# EAGLE design shift-register-daughter (EAGLE 6.6.0)
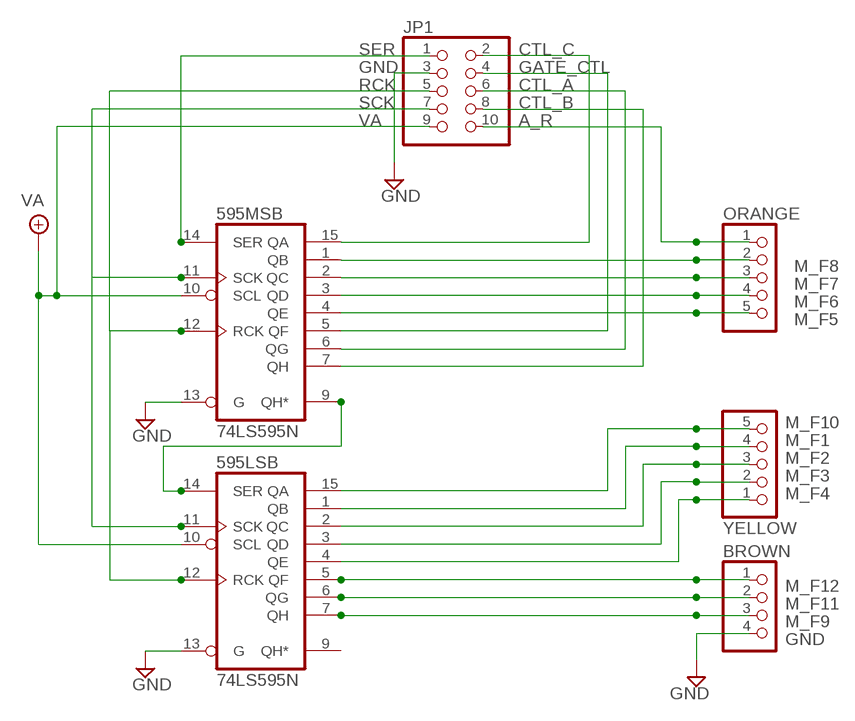
[diagram p0: schematic, sheet 1]

## Parts
595LSB  74LS595N  [DIL16]
595MSB  74LS595N  [DIL16]
BROWN  PINHD-1X4  [1X04]
JP1  PINHD-2X5  [2X05]
ORANGE  PINHD-1X5  [1X05]
YELLOW  PINHD-1X5  [1X05]

## Nets
A_R: JP1.10 ORANGE.1
CTL_A: 595MSB.6(QG) JP1.6
CTL_B: 595MSB.7(QH) JP1.8
CTL_C: 595MSB.15(QA) JP1.2
GATE_CTL: 595MSB.5(QF) JP1.4
GND: 595LSB.13(G) 595MSB.13(G) BROWN.4 JP1.3
M_F1: 595LSB.1(QB) YELLOW.4
M_F2: 595LSB.2(QC) YELLOW.3
M_F3: 595LSB.3(QD) YELLOW.2
M_F4: 595LSB.4(QE) YELLOW.1
M_F5: 595MSB.4(QE) ORANGE.5
M_F6: 595MSB.3(QD) ORANGE.4
M_F7: 595MSB.2(QC) ORANGE.3
M_F8: 595MSB.1(QB) ORANGE.2
M_F9: 595LSB.7(QH) BROWN.3
M_F10: 595LSB.15(QA) YELLOW.5
M_F11: 595LSB.6(QG) BROWN.2
M_F12: 595LSB.5(QF) BROWN.1
N$1: 595LSB.14(SER) 595MSB.9(QH*)
RCK: 595LSB.12(RCK) 595MSB.12(RCK) JP1.5
SCK: 595LSB.11(SCK) 595MSB.11(SCK) JP1.7
SER: 595MSB.14(SER) JP1.1
VA: 595LSB.10(SCL) 595MSB.10(SCL) JP1.9
Unconnected: 595LSB.9(QH*)

## Power pins joined to a net without a drawn wire
GND: 595LSB.8(GND) 595MSB.8(GND)
VCC: 595LSB.16(VCC) 595MSB.16(VCC)

## Library data of the parts
595LSB 595MSB = 74xx-us:74*595: 8-bit SHIFT REGISTER, output latch
BROWN = pinhead:PINHD-1X4: PIN HEADER
JP1 = pinhead:PINHD-2X5: PIN HEADER
ORANGE YELLOW = pinhead:PINHD-1X5: PIN HEADER

## Board
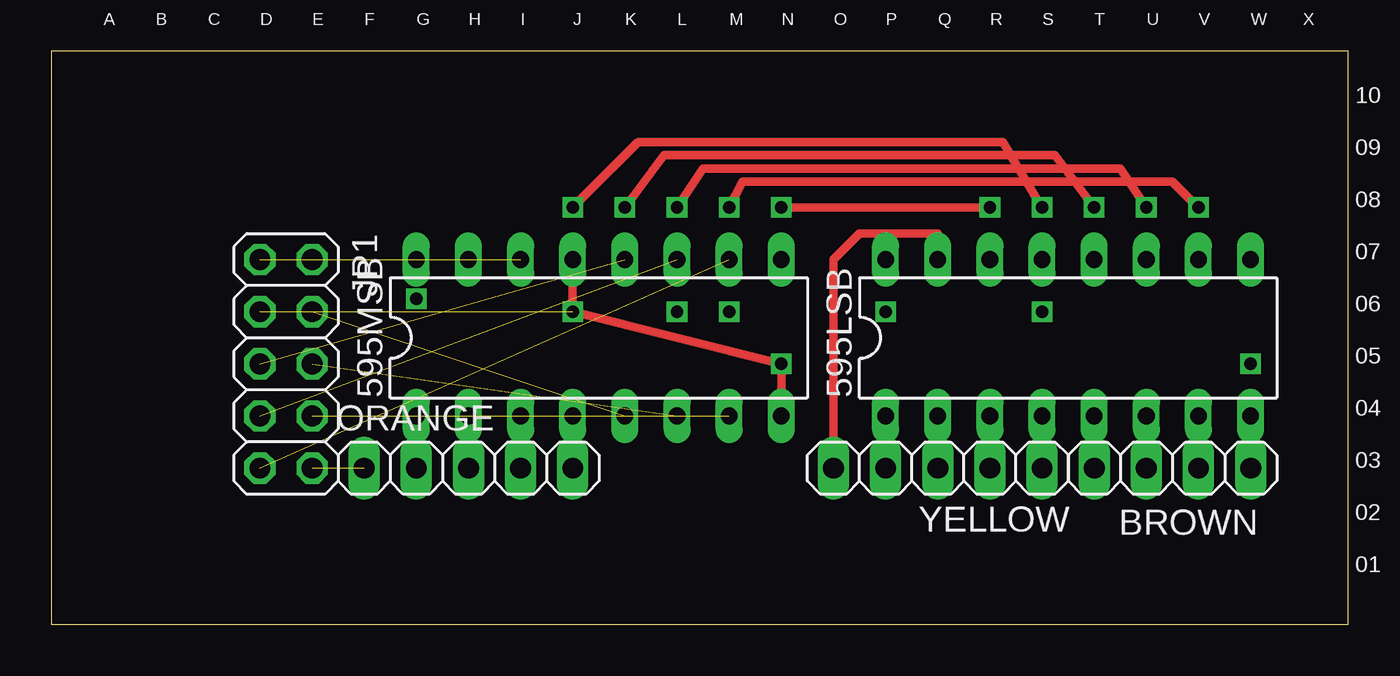
[diagram p1: board, top side]
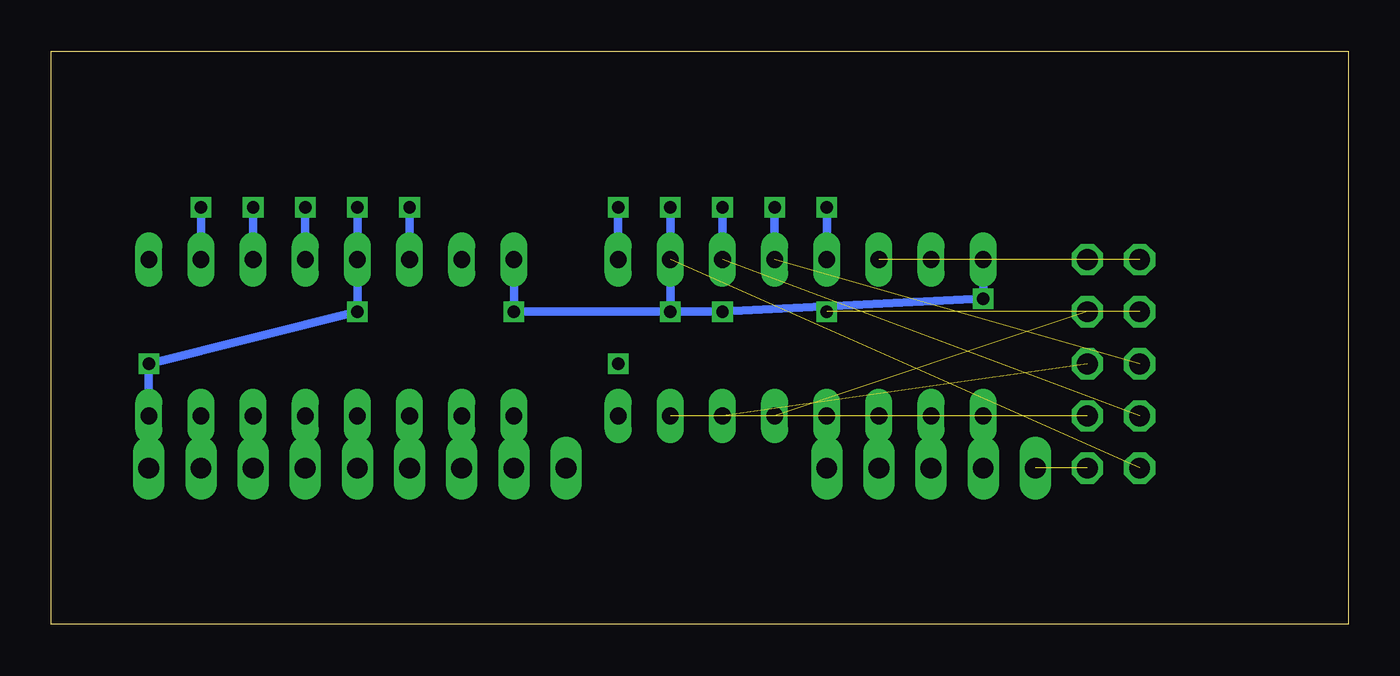
[diagram p2: board, bottom side, seen from below]

Size 63.17 x 27.93 mm. Coordinates in mm from the lower left corner, seen from the top.
Outline: 0,0 63.17,0 63.17,27.93 0,27.93 0,0
Copper layers (1*16): Top 0.035mm / dielectric 1.5mm / Bottom 0.035mm
Design rules "default": minimum track width 10mil, minimum drill 24mil, track to track 8mil, track to pad 8mil, pad to pad 8mil, via to via 8mil, smd to smd 8mil, copper to edge 40mil, drill to drill 8mil, minimum pad ring 10mil, minimum via ring 8mil, stop-mask expansion 4mil, vias tented up to drill 0mil, thermal gap 10mil

### Footprints (pad centres in the part's own frame; a part is rotated, then mirrored left to right if it is on the bottom)
DIL16 = drill 0.813 long: 1 -8.89,-3.81; 2 -6.35,-3.81; 3 -3.81,-3.81; 4 -1.27,-3.81; 5 1.27,-3.81; 6 3.81,-3.81; 7 6.35,-3.81; 8 8.89,-3.81; 9 8.89,3.81; 10 6.35,3.81; 11 3.81,3.81; 12 1.27,3.81; 13 -1.27,3.81; 14 -3.81,3.81; 15 -6.35,3.81; 16 -8.89,3.81
1X04 = drill 1.016 long: 1 -3.81,0; 2 -1.27,0; 3 1.27,0; 4 3.81,0
2X05 = drill 1.016 octagon: 1 -5.08,-1.27; 2 -5.08,1.27; 3 -2.54,-1.27; 4 -2.54,1.27; 5 0,-1.27; 6 0,1.27; 7 2.54,-1.27; 8 2.54,1.27; 9 5.08,-1.27; 10 5.08,1.27
1X05 = drill 1.016 long: 1 -5.08,0; 2 -2.54,0; 3 0,0; 4 2.54,0; 5 5.08,0

### Placement (x,y rotation side)
595LSB  49.53,13.97 0 top
595MSB  26.67,13.97 0 top
BROWN  54.61,7.62 0 top
JP1  11.43,12.7 270 top
ORANGE  20.32,7.62 0 top
YELLOW  43.18,7.62 180 top

### Tracks (layer width: path | path; a pad name or v marks a point on that pad's centre or on a via)
A_R  (1 unrouted)
CTL_A  (1 unrouted)
CTL_B  (1 unrouted)
CTL_C  (1 unrouted)
GATE_CTL  (1 unrouted)
GND  (via drill 0.6)  (1 unrouted)
  Top 0.406: v25.4,20.32 28.57,23.5 46.35,23.5 v48.26,20.32 | 595MSB.13 v25.4,15.24 v35.56,12.7 595MSB.8
  Bottom 0.406: BROWN.4 595LSB.8 v58.42,12.7 v48.26,15.24 595LSB.13 v48.26,20.32 | 595MSB.13 v25.4,20.32
M_F1
  Bottom 0.406: 595LSB.1 YELLOW.4
M_F2
  Bottom 0.406: 595LSB.2 YELLOW.3
M_F3
  Bottom 0.406: 595LSB.3 YELLOW.2
M_F4
  Bottom 0.406: 595LSB.4 YELLOW.1
M_F5
  Bottom 0.406: 595MSB.4 ORANGE.5
M_F6
  Bottom 0.406: 595MSB.3 ORANGE.4
M_F7
  Bottom 0.406: 595MSB.2 ORANGE.3
M_F8
  Bottom 0.406: ORANGE.2 595MSB.1
M_F9
  Bottom 0.406: 595LSB.7 BROWN.3
M_F10
  Top 0.406: YELLOW.5 38.1,17.78 39.37,19.05 43.18,19.05 595LSB.15
M_F11
  Bottom 0.406: 595LSB.6 BROWN.2
M_F12
  Bottom 0.406: 595LSB.5 BROWN.1
N$1  (via drill 0.6)
  Top 0.406: v45.72,20.32 v35.56,20.32
  Bottom 0.406: 595LSB.14 v45.72,20.32 | v35.56,20.32 595MSB.9
RCK  (via drill 0.6)  (1 unrouted)
  Top 0.406: v27.94,20.32 29.84,22.86 48.9,22.86 v50.8,20.32
  Bottom 0.406: v27.94,20.32 595MSB.12 | 595LSB.12 v50.8,20.32
SCK  (via drill 0.6)  (1 unrouted)
  Top 0.406: v30.48,20.32 31.75,22.23 52.07,22.23 v53.34,20.32
  Bottom 0.406: 595MSB.11 v30.48,20.32 | 595LSB.11 v53.34,20.32
SER  (1 unrouted)
VA  (via drill 0.6)  (1 unrouted)
  Top 0.406: v55.88,20.32 54.61,21.59 33.66,21.59 v33.02,20.32
  Bottom 0.406: v33.02,20.32 595MSB.10 | 595LSB.10 v55.88,20.32
VCC  (via drill 0.6)
  Bottom 0.406: 595LSB.16 v40.64,15.24 v33.02,15.24 | v33.02,15.24 33.02,17.78 | 595MSB.16 v17.78,15.88 v30.48,15.24 v33.02,15.24

### Text on the board
tNames: A | B | C | D | E | F | G | H | I | J | K | L | M | N | O | P | Q | R | S | T | U | V | W | X | 10 | 09 | 08 | 07 | 06 | 05 | 04 | 03 | 02 | 01